# EAGLE design logic_probe_v2 (EAGLE 7.3.0)
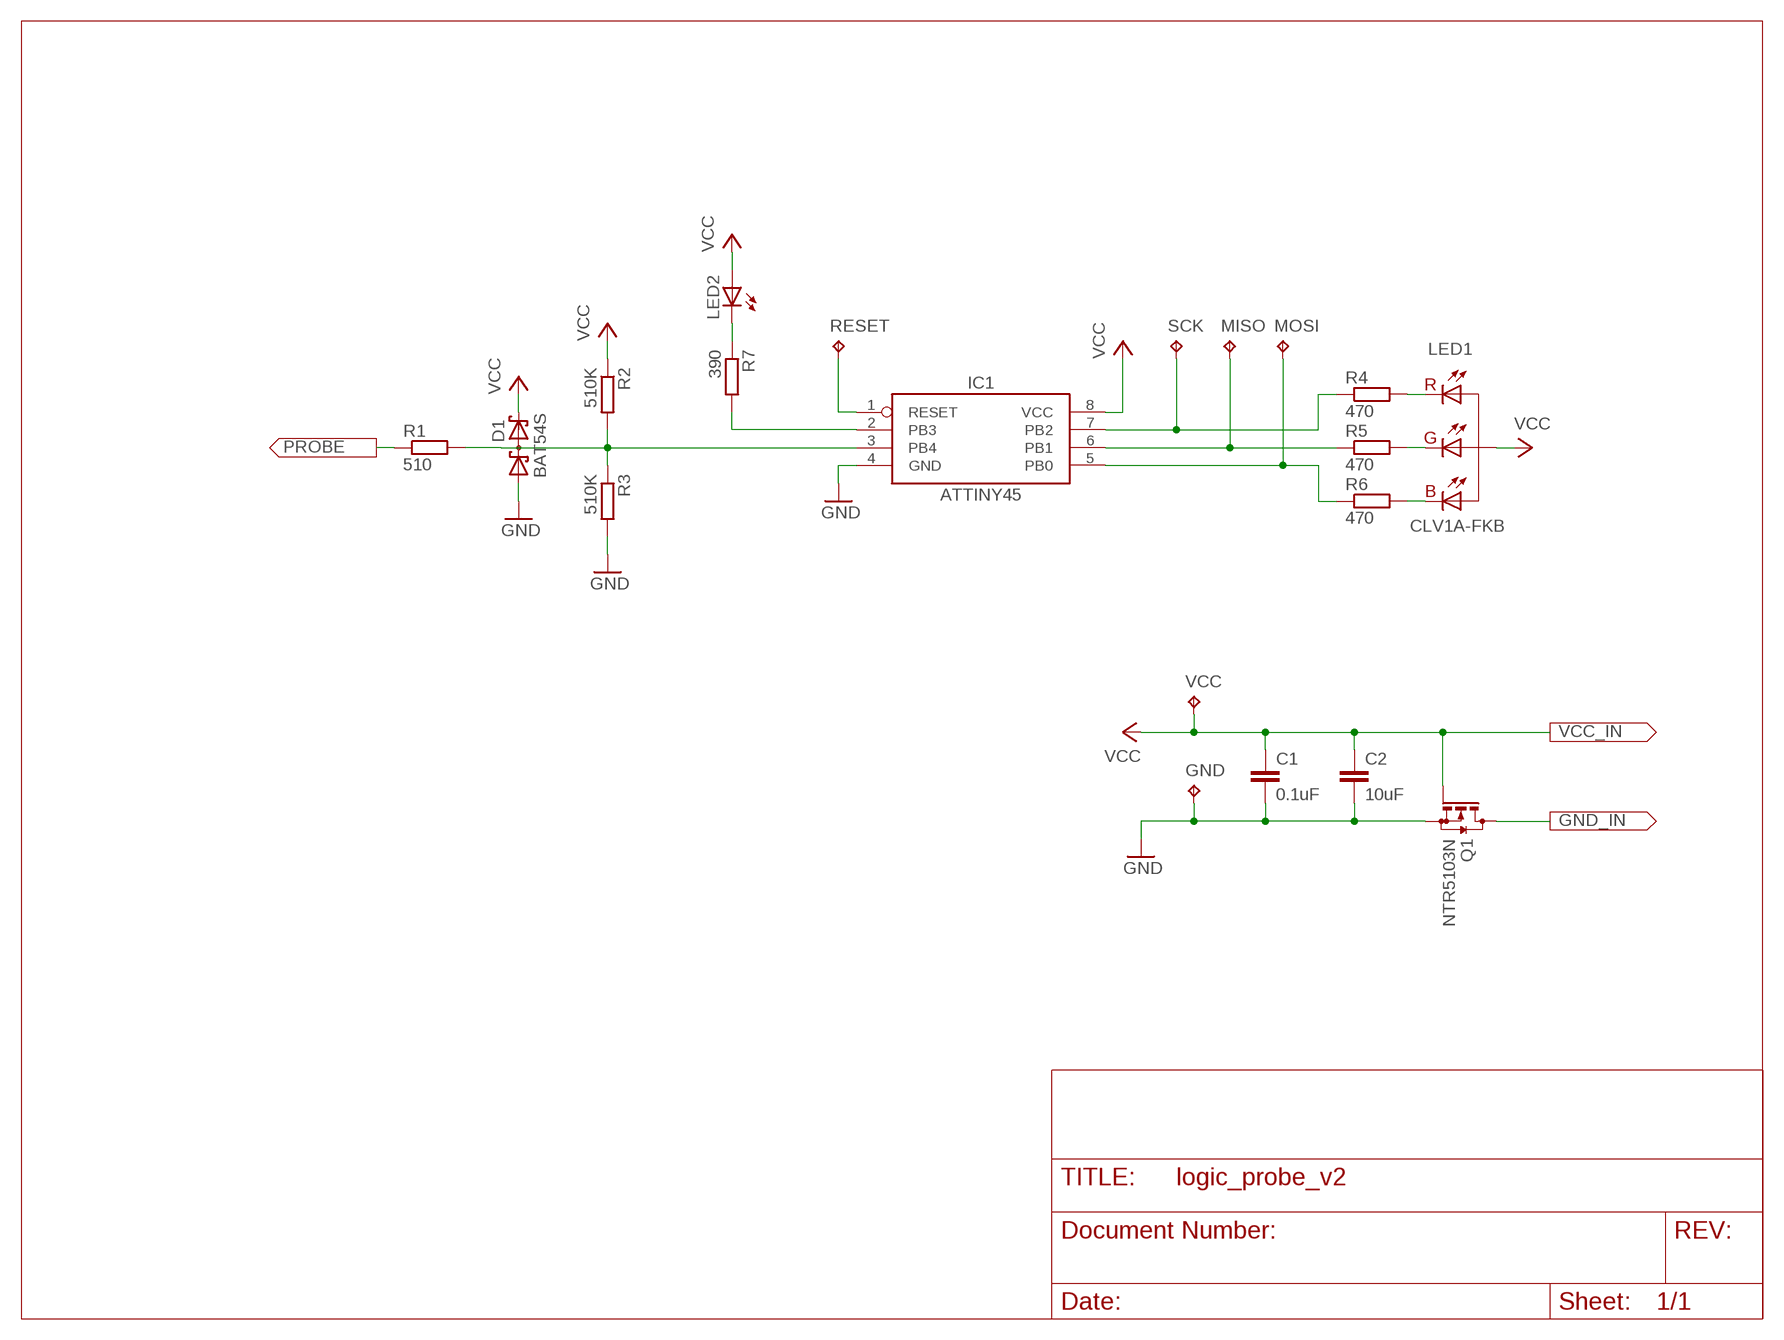
[diagram p0: schematic, sheet 1]

## Parts
C1  0.1uF  C-EUC0805  [C0805]
C2  10uF  C-EUC0805  [C0805]
D1  BAT54S  [SOT23]
GND  TPB1,27  [B1,27]
IC1  ATTINY45  [TSSOP8]
LED1  CLV1A-FKB  [PLCC-4]
LED2  LEDCHIPLED_0805  [CHIPLED_0805]
MISO  TPB1,27  [B1,27]
MOSI  TPB1,27  [B1,27]
Q1  NTR5103N  [SOT23]
R1  510  R-EU_R0805  [R0805]
R2  510K  R-EU_R0805  [R0805]
R3  510K  R-EU_R0805  [R0805]
R4  470  R-EU_R0805  [R0805]
R5  470  R-EU_R0805  [R0805]
R6  470  R-EU_R0805  [R0805]
R7  390  R-EU_R0805  [R0805]
RESET  TPB1,27  [B1,27]
SCK  TPB1,27  [B1,27]
VCC  TPB1,27  [B1,27]

## Nets
GND: C1.2 C2.2 D1.1(A1) GND.TP IC1.4(GND) Q1.2(S) R3.2
GND_IN: Q1.3(D)
N$1: LED1.1(R) R4.2
N$2: LED1.3(G) R5.2
N$3: LED1.4(B) R6.2
N$4: IC1.7(PB2) R4.1 SCK.TP
N$5: IC1.6(PB1) MISO.TP R5.1
N$6: IC1.5(PB0) MOSI.TP R6.1
N$7: IC1.2(PB3) R7.2
N$8: LED2.C R7.1
N$9: IC1.1(RESET) RESET.TP
PROBE: R1.1
VCC: C1.1 C2.1 D1.2(C2) IC1.8(VCC) LED1.2(CA) LED2.A Q1.1(G) R2.1 VCC.TP
VIN: D1.3(C1A2) IC1.3(PB4) R1.2 R2.2 R3.1

## Library data of the parts
C1 C2 = rcl:C-EU: CAPACITOR, European symbol
D1 = diode:BAT54S: Schottky Diodes Pin connection corrected 2011-05-04 Source: Fairchild .. BAT54.pdf
GND MISO MOSI RESET SCK VCC = testpad:TP: Test pad
IC1 = logic_probe:ATTINY45
LED1 = logic_probe:CLV1A-FKB: Cree PLCC4 3 in 1 SMD LED
LED2 = led:LED: LED OSRAM: - CHIPLED LG R971, LG N971, LY N971, LG Q971, LY Q971, LO R971, LY R971 LH N974, LH R974 LS Q976, LO Q976, LY Q976 LO Q996 - Hyper CHIPLED LW Q18S LB Q993, LB Q99A, LB R99A - SideLED LS A670, LO A670, LY A670, LG A670, LP A670 LB A673, LV A673, LT A673, LW A673 LH A674 LY A675 LS A676, LA A676, LO A676, LY A676, LW A676 LS A679, LY A679, LG A679 - Hyper Micro SIDELED® LS Y876, LA Y876, LO Y876, LY Y876 LT Y87S - SmartLED LW L88C, LW L88S LB L89C, LB L89S, LG L890 LS L89K, LO L89K, LY L89K LS L896, LA L896, LO L896, LY L896 - TOPLED LS T670, LO T670, LY T670, LG T670, LP T670 LSG T670, LSP T670, LSY T670, LOP T670, LYG T670 LG T671, LOG T671, LSG T671 LB T673, LV T673, LT T673, LW T673 LH T674 LS T676, LA T676, LO T676, LY T676, LB T676, LH T676, LSB T676, LW T676 LB T67C, LV T67C, LT T67C, LS T67K, LO T67K, LY T67K, LW E67C LS E67B, LA E67B, LO E67B, LY E67B, LB E67C, LV E67C, LT E67C LW T67C LS T679, LY T679, LG T679 LS T770, LO T770, LY T770, LG T770, LP T770 LB T773, LV T773, LT T773, LW T773 LH T774 LS E675, LA E675, LY E675, LS T675 LS T776, LA T776, LO T776, LY T776, LB T776 LHGB T686 LT T68C, LB T68C - Hyper Mini TOPLED® LB M676 - Mini TOPLED Santana® LG M470 LS M47K, LO M47K, LY M47K Source: http://www.osram.convergy.de LUXEON: - LUMILED® LXK2-PW12-R00, LXK2-PW12-S00, LXK2-PW14-U00, LXK2-PW14-V00 LXK2-PM12-R00, LXK2-PM12-S00, LXK2-PM14-U00 LXK2-PE12-Q00, LXK2-PE12-R00, LXK2-PE12-S00, LXK2-PE14-T00, LXK2-PE14-U00 LXK2-PB12-K00, LXK2-PB12-L00, LXK2-PB12-M00, LXK2-PB14-N00, LXK2-PB14-P00, LXK2-PB14-Q00 LXK2-PR12-L00, LXK2-PR12-M00, LXK2-PR14-Q00, LXK2-PR14-R00 LXK2-PD12-Q00, LXK2-PD12-R00, LXK2-PD12-S00 LXK2-PH12-R00, LXK2-PH12-S00 LXK2-PL12-P00, LXK2-PL12-Q00, LXK2-PL12-R00 Source: www.luxeon.com KINGBRIGHT: KA-3528ASYC Source: www.kingbright.com
Q1 = logic_probe:NTR5103N: N-CHANNEL Small Signal MOSFET
R1-R7 = rcl:R-EU_: RESISTOR, European symbol

## Board
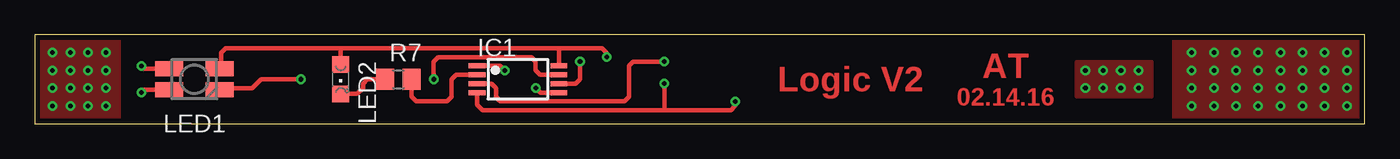
[diagram p1: board, top side]
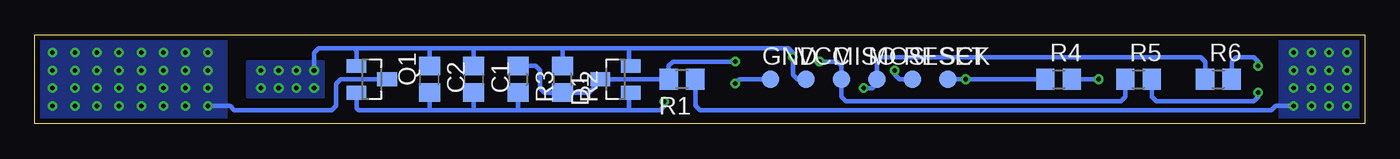
[diagram p2: board, bottom side, seen from below]

Size 95.25 x 6.35 mm. Coordinates in mm from the lower left corner, seen from the top.
Outline: 0,0 95.25,0 95.25,6.35 0,6.35 0,0
Copper layers (1*16): Top 0.0356mm / dielectric 1.5011mm / Bottom 0.0356mm
Design rules "LaenPCBOrder": minimum track width 6mil, minimum drill 13mil, track to track 6mil, track to pad 6mil, pad to pad 6mil, via to via 6mil, smd to smd 6mil, copper to edge 15mil, drill to drill 6mil, minimum pad ring 7mil, minimum via ring 7mil, stop-mask expansion 3mil, vias tented up to drill 0mil, thermal gap 10mil

### Footprints (pad centres in the part's own frame; a part is rotated, then mirrored left to right if it is on the bottom)
C0805 = smd 1.3 x 1.5: 1 -0.95,0; 2 0.95,0
SOT23 = smd 1 x 1.4: 1 -0.95,-1.1; 2 0.95,-1.1; 3 0,1.1
B1,27 = smd 1.27 x 1.27: TP 0,0
TSSOP8 = smd 1.2 x 0.35: 1 -2.925,0.975; 2 -2.925,0.325; 3 -2.925,-0.325; 4 -2.925,-0.975; 5 2.925,-0.975; 6 2.925,-0.325; 7 2.925,0.325; 8 2.925,0.975
PLCC-4 = smd 2 x 1.1: 1 -1.8,0.75; 2 -1.8,-0.75; 3 1.8,0.75; 4 1.8,-0.75
CHIPLED_0805 = smd 1.2 x 1.2: A 0,-1.05; C 0,1.05
R0805 = smd 1.3 x 1.5: 1 -0.95,0; 2 0.95,0

### Placement (x,y rotation side)
C1  63.82,3.17 270 bottom
C2  66.99,3.17 270 bottom
D1  53.66,3.17 90 bottom
GND  42.55,3.17 0 bottom
IC1  34.61,3.17 0 top
LED1  11.43,3.17 180 top
LED2  21.91,3.17 180 top
MISO  37.47,3.17 0 bottom
MOSI  34.92,3.17 0 bottom
Q1  71.12,3.17 270 bottom
R1  48.9,3.17 180 bottom
R2  57.47,3.17 270 bottom
R3  60.64,3.17 270 bottom
R4  21.91,3.17 0 bottom
R5  16.19,3.17 0 bottom
R6  10.48,3.17 0 bottom
R7  26.04,3.17 0 top
RESET  32.38,3.17 0 bottom
SCK  29.84,3.17 0 bottom
VCC  40.01,3.17 0 bottom

### Tracks (layer width: path | path; a pad name or v marks a point on that pad's centre or on a via)
GND  (via drill 0.33)
  Top 0.305: IC1.4 31.68,1.34 32.07,0.95 45.09,0.95 | 45.09,0.95 49.85,0.95 50.16,1.27 v50.16,1.59 | v45.09,2.86 45.09,0.95
  Bottom 0.305: 66.99,0.95 72.07,0.95 72.22,1.1 Q1.2 | 66.99,0.95 63.82,0.95 | 63.82,0.95 60.64,0.95 | 60.64,0.95 52.7,0.95 | 52.7,0.95 50.48,0.95 50.16,1.27 v50.16,1.59 | C2.2 66.99,0.95 | C1.2 63.82,0.95 | R3.2 60.64,0.95 | D1.1 52.7,2.23 52.7,2.22 52.7,0.95 | GND.TP 44.77,3.17 v45.09,2.86
GND_IN  (via drill 0.33)
  Bottom 0.305: Q1.3 73.34,3.17 73.66,2.86 73.66,1.27 73.98,0.95 80.96,0.95 81.28,1.27 v82.87,1.27
  other vias: 92.39,2.54 82.87,2.54 84.45,1.27 93.98,2.54 93.98,1.27 92.39,1.27 82.87,5.08 86.04,5.08 90.81,5.08 92.39,5.08 93.98,5.08 84.45,5.08 82.87,3.81 92.39,3.81 93.98,3.81 89.22,5.08 87.63,5.08 84.45,2.54 84.45,3.81 86.04,3.81 86.04,2.54 86.04,1.27 87.63,3.81 89.22,3.81 90.81,3.81 90.81,2.54 90.81,1.27 89.22,1.27 87.63,1.27 87.63,2.54 89.22,2.54
  pour Top (no thermals): 94.93,0.32 94.93,6.03 81.6,6.03 81.6,0.32
  pour Bottom (no thermals): 81.6,6.03 94.93,6.03 94.93,0.32 81.6,0.32
N$1  (via drill 0.33)
  Top 0.305: v19.05,3.17 16.19,3.17 15.56,2.54 13.35,2.54 LED1.1
  Bottom 0.305: R4.2 v19.05,3.17
N$2  (via drill 0.33)
  Top 0.305: LED1.3 7.82,2.42 v7.62,2.22
  Bottom 0.305: v7.62,2.22 7.62,1.91 7.94,1.59 14.92,1.59 15.24,1.91 R5.2
N$3  (via drill 0.33)
  Top 0.305: LED1.4 7.82,3.92 v7.62,4.13
  Bottom 0.305: v7.62,4.13 7.62,4.45 7.94,4.76 9.21,4.76 9.53,4.45 R6.2
N$4  (via drill 0.33)
  Top 0.305: IC1.7 36.2,3.5 36.2,3.49 35.88,3.81 35.88,4.45 35.56,4.76 28.89,4.76 28.57,4.45 v28.57,3.17
  Bottom 0.305: R4.1 v28.57,3.17 SCK.TP
N$5  (via drill 0.33)
  Top 0.305: IC1.6 38.73,2.85 39.05,3.17 v39.05,4.45
  Bottom 0.305: R5.1 17.14,2.23 17.14,2.22 17.14,1.91 17.46,1.59 37.15,1.59 37.47,1.91 MISO.TP 37.47,4.13 37.78,4.45 v39.05,4.45
N$6  (via drill 0.33)
  Top 0.305: IC1.5 36.22,2.2 v35.88,2.54
  Bottom 0.305: R6.1 11.43,4.44 11.75,4.76 34.61,4.76 34.92,4.45 MOSI.TP 34.92,2.86 35.24,2.54 v35.88,2.54
N$7
  Top 0.305: IC1.2 30.17,3.5 29.84,3.17 29.84,1.91 29.53,1.59 27.3,1.59 26.99,1.91 R7.2
N$8
  Top 0.305: LED2.C 23.08,2.12 23.5,2.54 23.5,2.86 23.81,3.17 R7.1
N$9  (via drill 0.33)
  Top 0.305: IC1.1 33.31,4.15 v33.66,3.81
  Bottom 0.305: v33.66,3.81 33.66,3.49 33.34,3.17 RESET.TP
PROBE  (via drill 0.33)
  Bottom 0.305: v5.08,1.27 6.35,1.27 6.67,0.95 47.62,0.95 47.94,1.27 R1.1
  other vias: 3.81,2.54 1.27,5.08 2.54,5.08 3.81,5.08 5.08,5.08 5.08,3.81 5.08,2.54 2.54,3.81 1.27,2.54 1.27,3.81 2.54,2.54 2.54,1.27 3.81,1.27 1.27,1.27 3.81,3.81
  pour Bottom (no thermals): 0,6.35 6.03,6.35 6.03,0 0,0
  pour Top (no thermals): 0,6.35 6.03,6.35 6.03,0 0,0
VCC  (via drill 0.33)
  Top 0.305: LED1.2 13.35,3.81 13.34,5.08 13.65,5.4 21.91,5.4 | 21.91,5.4 37.47,5.4 | 37.47,5.4 40.64,5.4 40.96,5.08 v40.96,4.76 | LED2.A 21.91,5.4 | IC1.8 37.53,5.33 37.47,5.4
  Bottom 0.305: 66.99,5.4 63.82,5.4 | 63.82,5.4 57.47,5.4 | 57.47,5.4 52.7,5.4 | 52.7,5.4 41.27,5.4 40.96,5.08 v40.96,4.76 40.96,3.49 40.64,3.17 VCC.TP | R2.1 57.47,5.4 | D1.2 52.7,4.27 52.7,5.4 | 72.39,5.4 74.93,5.4 75.25,5.08 v75.25,3.81 | 72.39,5.4 66.99,5.4 | Q1.1 72.22,5.23 72.39,5.4 | C2.1 66.99,5.4 | C1.1 63.82,5.4
  other vias: 76.52,3.81 77.79,3.81 79.06,3.81 79.06,2.54 77.79,2.54 76.52,2.54 75.25,2.54
  pour Top (no thermals): 80.01,4.45 74.61,4.45 74.61,1.91 80.01,1.91
  pour Bottom (no thermals): 74.61,4.45 80.01,4.45 80.01,1.91 74.61,1.91
VIN  (via drill 0.33)
  Top 0.305: IC1.3 32.71,2.85 33.02,2.54 33.02,1.91 33.34,1.59 42.23,1.59 42.55,1.91 42.55,4.13 42.86,4.45 v45.09,4.45
  Bottom 0.305: R3.1 59.37,4.13 59.05,3.81 59.05,2.54 58.74,2.22 58.74,2.23 R2.2 55.56,2.22 54.76,3.03 D1.3 R1.2 49.84,4.12 49.85,4.13 49.53,4.45 v45.09,4.45

### Text on the board
Top: AT | Logic V2 | 02.14.16